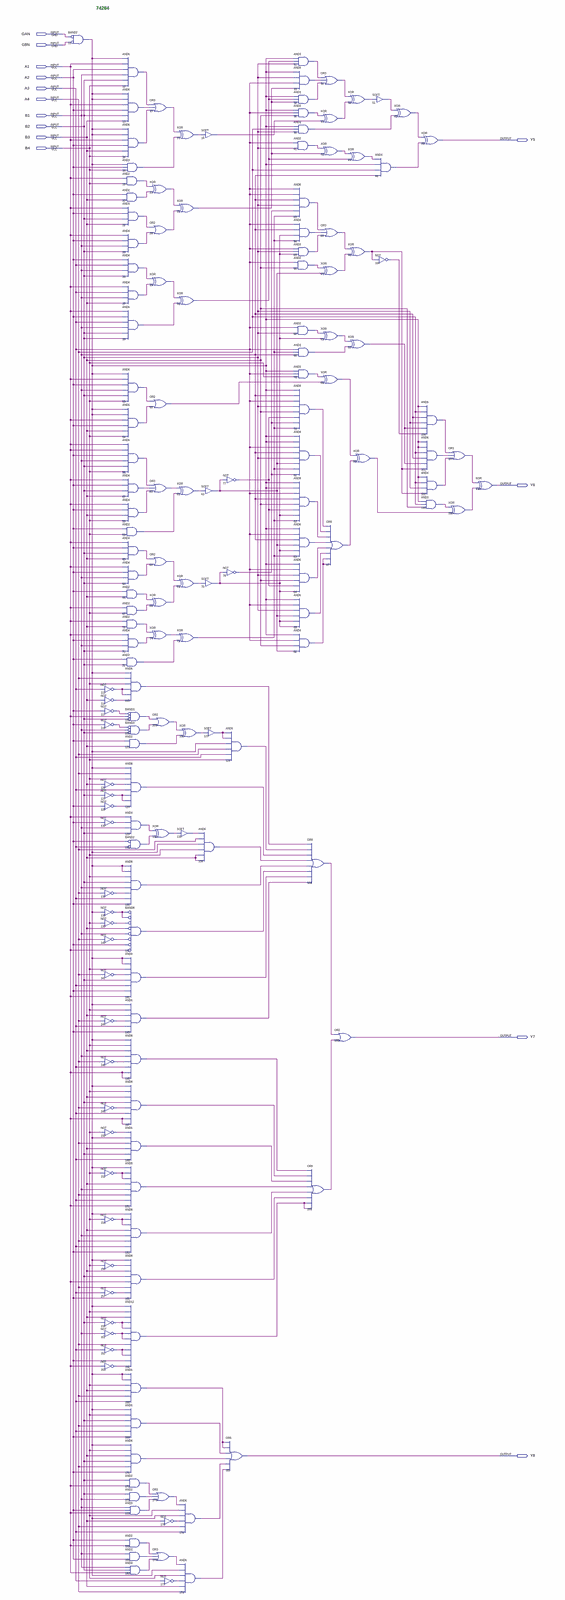
[diagram p0: schematic sheet, whole]
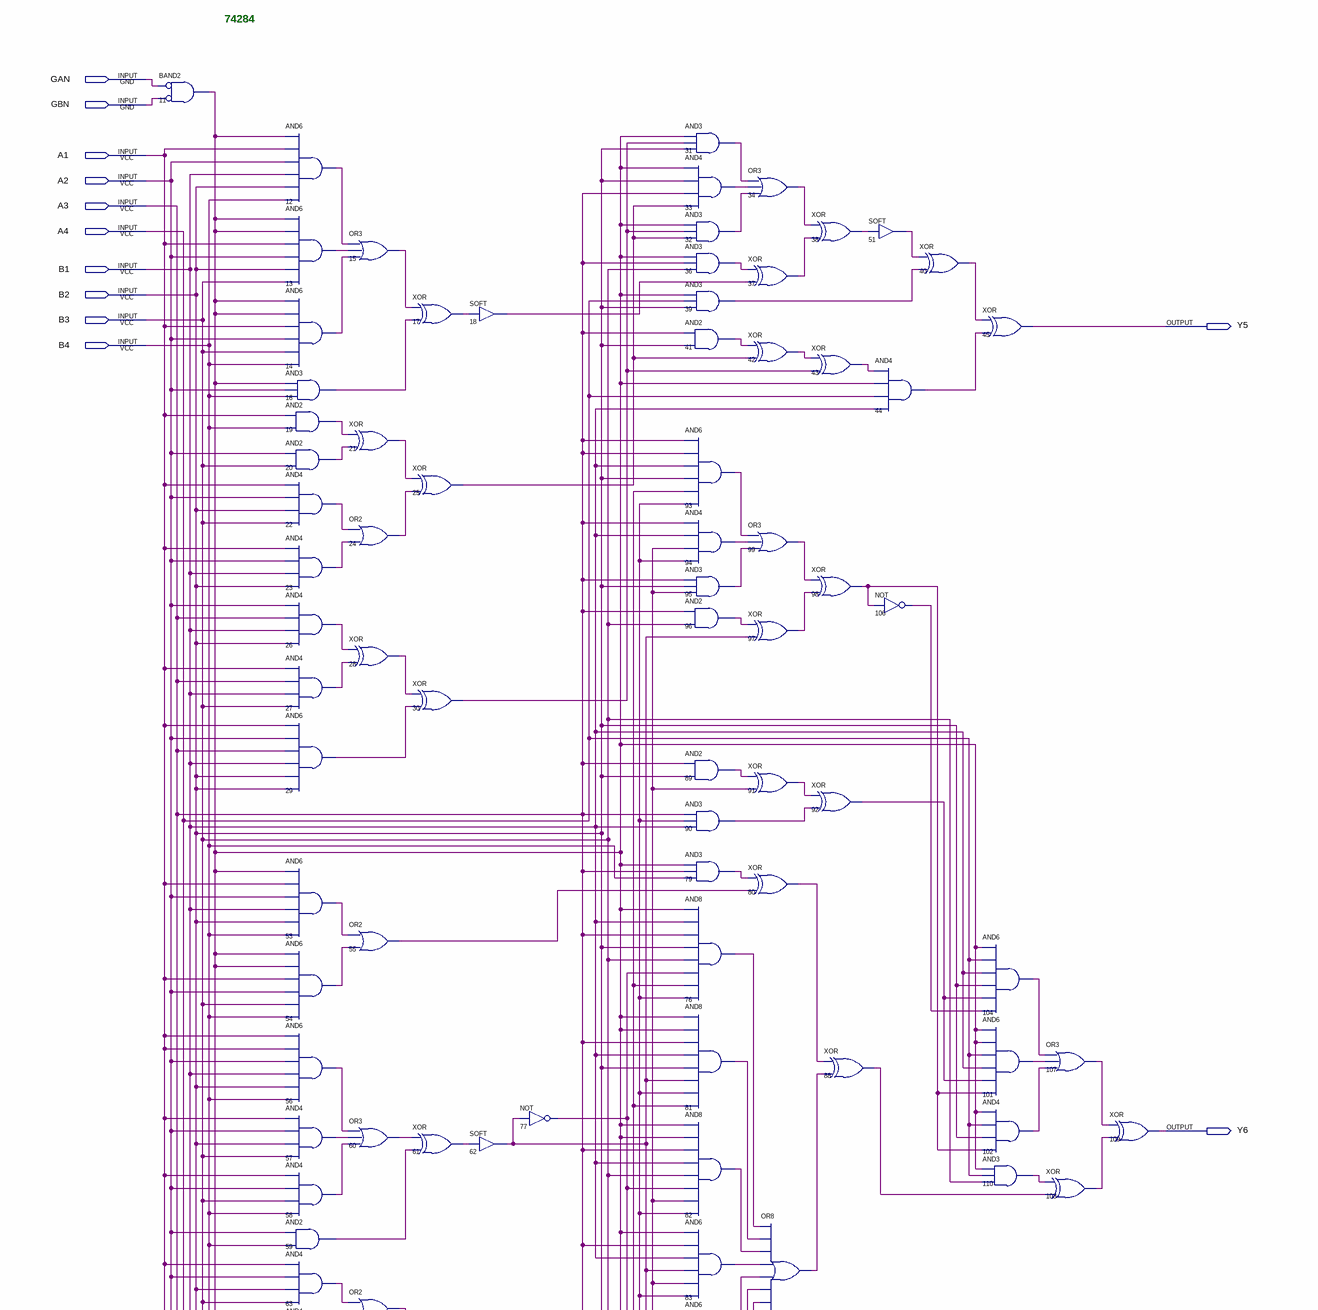
[diagram p1: schematic sheet, upper part]
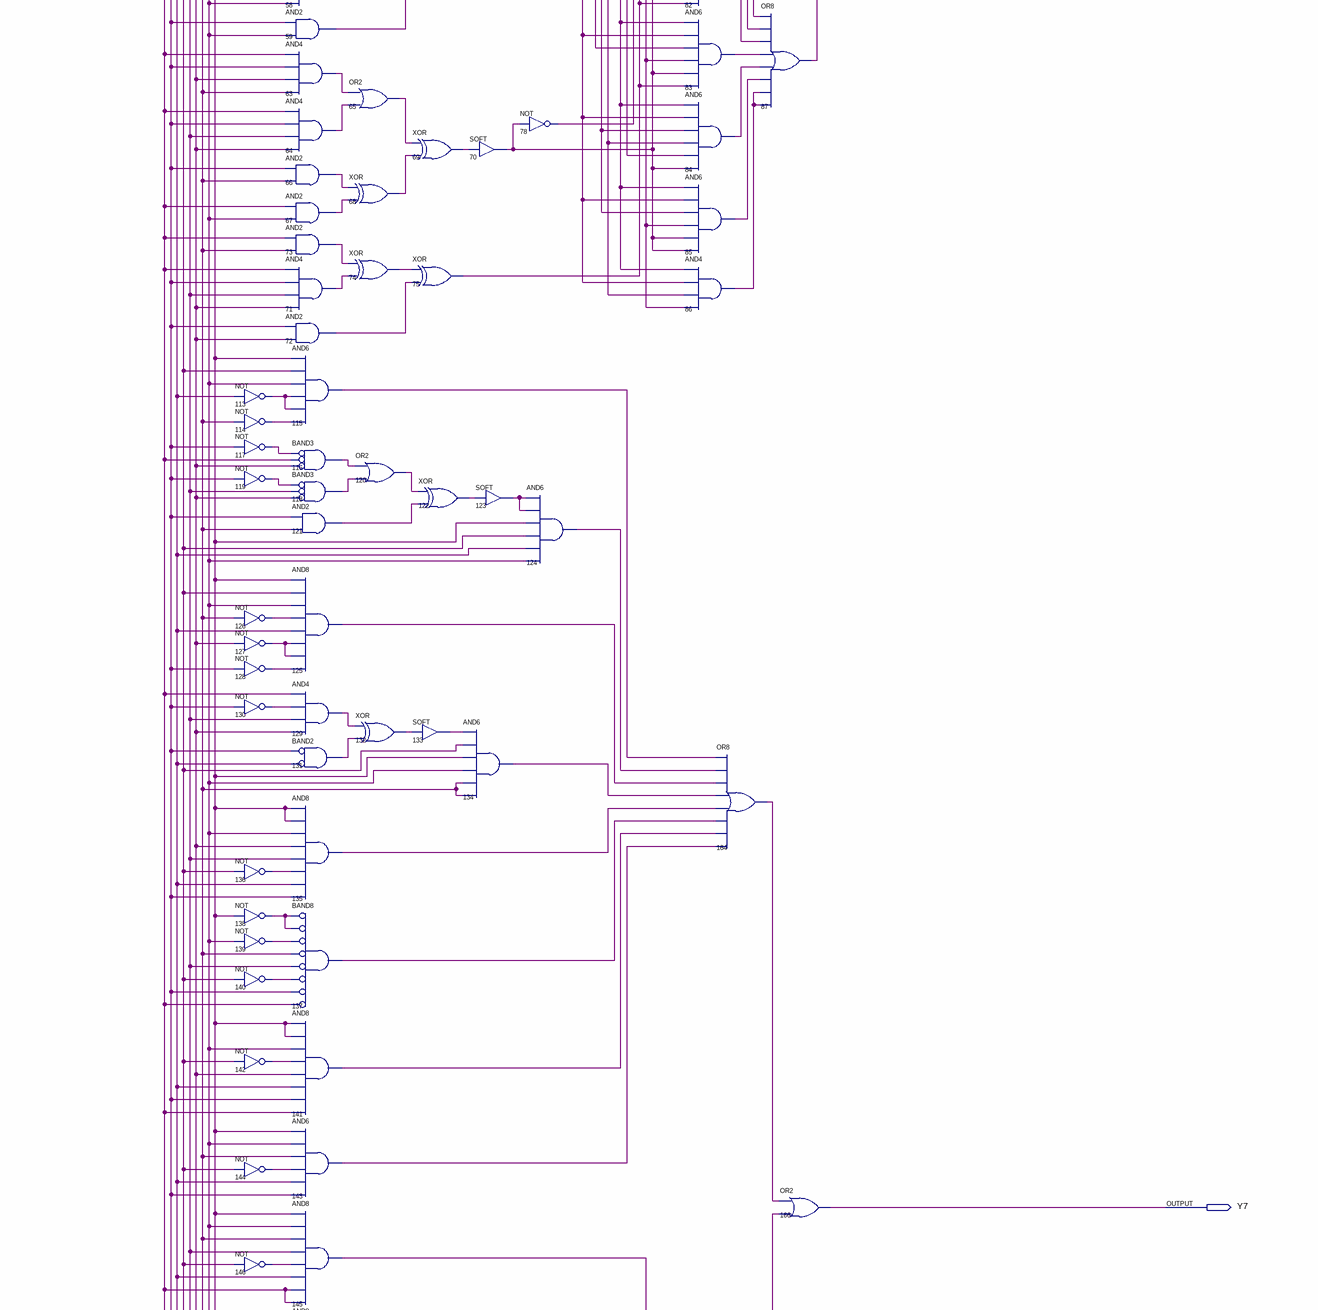
[diagram p2: schematic sheet, middle part]
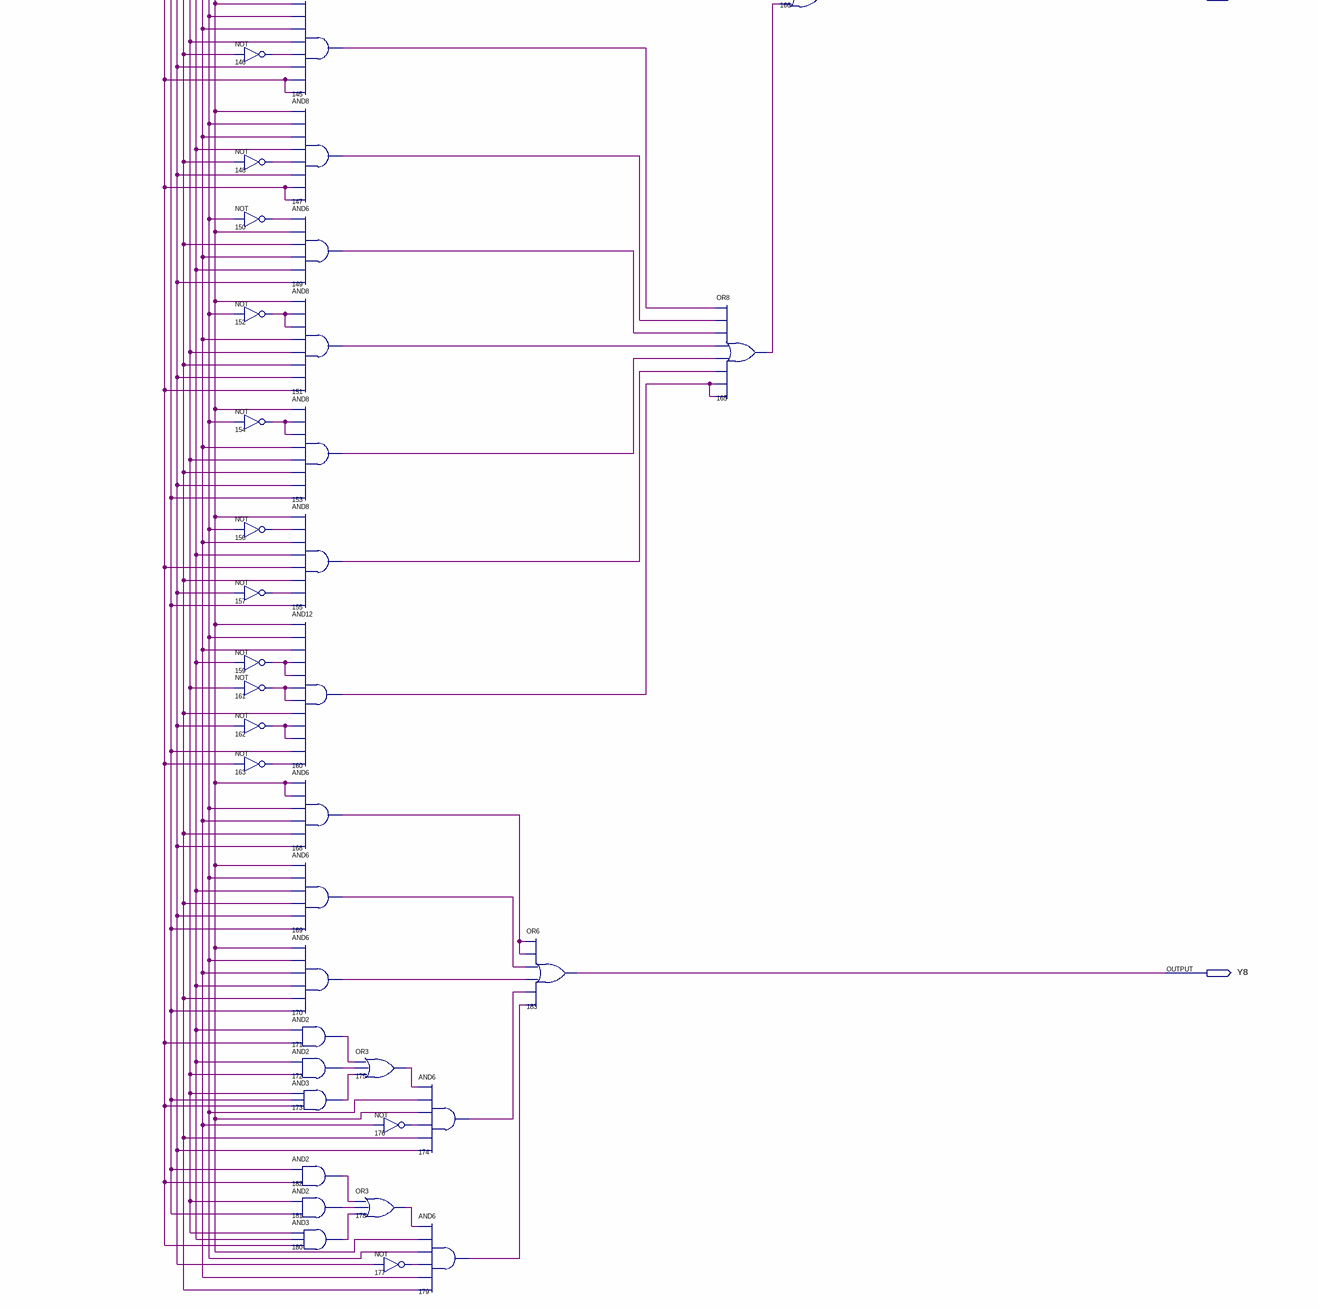
[diagram p3: schematic sheet, lower part]
// Quartus schematic 74284.bdf as structural Verilog: 159 symbols, 14 pins
module \74284  (
  input  GAN,
  input  GBN,
  input  A1,
  input  A2,
  input  A3,
  input  A4,
  input  B1,
  input  B2,
  input  B3,
  input  B4,
  output Y5,
  output Y6,
  output Y7,
  output Y8
);

  wire n11_out, n12_out, n13_out, n14_out, n15_out, n16_out, n17_out, n18_out, n19_out, n20_out, n21_out,
       n22_out, n23_out, n24_out, n25_out, n26_out, n27_out, n28_out, n29_out, n30_out, n31_out, n32_out,
       n33_out, n34_out, n36_out, n37_out, n38_out, n39_out, n40_out, n41_out, n42_out, n43_out, n44_out,
       n51_out, n53_out, n54_out, n55_out, n56_out, n57_out, n58_out, n59_out, n60_out, n61_out, n62_out,
       n63_out, n64_out, n65_out, n66_out, n67_out, n68_out, n69_out, n70_out, n71_out, n72_out, n73_out,
       n74_out, n75_out, n76_out, n77_out, n78_out, n79_out, n80_out, n81_out, n82_out, n83_out, n84_out,
       n85_out, n86_out, n87_out, n88_out, n89_out, n90_out, n91_out, n92_out, n93_out, n94_out, n95_out,
       n96_out, n97_out, n98_out, n99_out, n101_out, n102_out, n104_out, n106_out, n107_out, n108_out,
       n110_out, n113_out, n114_out, n115_out, n116_out, n117_out, n118_out, n119_out, n120_out, n121_out,
       n122_out, n123_out, n124_out, n125_out, n126_out, n127_out, n128_out, n129_out, n130_out, n131_out,
       n132_out, n133_out, n134_out, n135_out, n136_out, n137_out, n138_out, n139_out, n140_out, n141_out,
       n142_out, n143_out, n144_out, n145_out, n146_out, n147_out, n148_out, n149_out, n150_out, n151_out,
       n152_out, n153_out, n154_out, n155_out, n156_out, n157_out, n159_out, n160_out, n161_out, n162_out,
       n163_out, n164_out, n165_out, n168_out, n169_out, n170_out, n171_out, n172_out, n173_out, n174_out,
       n175_out, n176_out, n177_out, n178_out, n179_out, n180_out, n181_out, n182_out;

  and u_11 (n11_out, ~GAN, ~GBN);  // BAND2
  not u_113 (n113_out, A3);
  not u_114 (n114_out, B3);
  not u_117 (n117_out, A2);
  not u_119 (n119_out, A2);
  not u_126 (n126_out, B3);
  not u_127 (n127_out, B2);
  not u_128 (n128_out, A2);
  not u_130 (n130_out, A2);
  not u_136 (n136_out, A4);
  not u_138 (n138_out, n11_out);
  not u_139 (n139_out, B4);
  not u_140 (n140_out, A4);
  not u_142 (n142_out, A4);
  not u_144 (n144_out, A4);
  not u_146 (n146_out, A4);
  not u_148 (n148_out, A4);
  not u_150 (n150_out, B4);
  not u_152 (n152_out, B4);
  not u_154 (n154_out, B4);
  not u_156 (n156_out, B4);
  not u_157 (n157_out, A3);
  not u_159 (n159_out, B2);
  not u_161 (n161_out, B1);
  not u_162 (n162_out, A3);
  not u_163 (n163_out, A1);
  and u_12 (n12_out, n11_out, A1, A2, B1, B2, B4);
  and u_13 (n13_out, n11_out, n11_out, A1, A2, B2, B3);
  and u_14 (n14_out, n11_out, n11_out, A1, A2, B3, B4);
  and u_16 (n16_out, n11_out, A2, B4);
  and u_19 (n19_out, A1, B4);
  and u_20 (n20_out, A2, B3);
  and u_22 (n22_out, A1, A2, B2, B3);
  and u_23 (n23_out, A1, A2, B1, B2);
  and u_26 (n26_out, A2, A3, B1, B2);
  and u_27 (n27_out, A1, A3, B1, B3);
  and u_29 (n29_out, A1, A2, A3, B1, B2, B2);
  and u_53 (n53_out, n11_out, A1, A2, B1, B2, B4);
  and u_54 (n54_out, n11_out, n11_out, A1, A2, B3, B4);
  and u_56 (n56_out, A1, A1, A2, B1, B2, B4);
  and u_57 (n57_out, A1, A2, B2, B3);
  and u_58 (n58_out, A1, A2, B3, B4);
  and u_59 (n59_out, A2, B4);
  and u_63 (n63_out, A1, A2, B2, B3);
  and u_64 (n64_out, A1, A2, B1, B2);
  and u_66 (n66_out, A2, B3);
  and u_67 (n67_out, A1, B4);
  and u_73 (n73_out, A1, B3);
  and u_71 (n71_out, A1, A2, B1, B2);
  and u_72 (n72_out, A2, B2);
  and u_115 (n115_out, n11_out, A4, B4, n113_out, n113_out, n114_out);
  and u_116 (n116_out, ~n117_out, ~A1, ~B2);  // BAND3
  and u_118 (n118_out, ~n119_out, ~B1, ~B2);  // BAND3
  and u_121 (n121_out, A2, B3);
  and u_125 (n125_out, n11_out, A4, B4, n126_out, A3, n127_out, n127_out, n128_out);
  and u_129 (n129_out, A1, n130_out, B1, B2);
  and u_131 (n131_out, ~A2, ~A3);  // BAND2
  and u_135 (n135_out, n11_out, n11_out, B4, B2, B1, n136_out, A3, A2);
  and u_137 (n137_out, ~n138_out, ~n138_out, ~n139_out, ~B3, ~B1, ~n140_out, ~A2, ~A1);  // BAND8
  and u_141 (n141_out, n11_out, n11_out, B4, n142_out, B2, A3, A2, A1);
  and u_143 (n143_out, n11_out, B4, B3, n144_out, A3, A2);
  and u_145 (n145_out, n11_out, B4, B3, B1, n146_out, A3, A1, A1);
  and u_147 (n147_out, n11_out, B4, B3, B2, n148_out, A3, A1, A1);
  and u_149 (n149_out, n150_out, n11_out, A4, B3, B2, A3);
  and u_151 (n151_out, n11_out, n152_out, n152_out, B3, B1, A4, A3, A1);
  and u_153 (n153_out, n11_out, n154_out, n154_out, B3, B1, A4, A3, A2);
  and u_155 (n155_out, n11_out, n156_out, B3, B2, A1, A4, n157_out, A2);
  and u_160 (n160_out, n11_out, B4, B3, n159_out, n159_out, n161_out, n161_out, A4, n162_out, n162_out, A2, n163_out);
  and u_168 (n168_out, n11_out, n11_out, B4, B3, A4, A3);
  and u_169 (n169_out, n11_out, B4, B2, A4, A3, A2);
  and u_170 (n170_out, n11_out, B4, B3, B2, A4, A2);
  and u_171 (n171_out, B2, A1);
  and u_172 (n172_out, B2, B1);
  and u_173 (n173_out, B1, A2, A1);
  and u_182 (n182_out, A2, A1);
  and u_181 (n181_out, B1, A2);
  and u_180 (n180_out, B1, B2, A1);
  or u_15 (n15_out, n12_out, n13_out, n14_out);
  xor u_21 (n21_out, n19_out, n20_out);
  or u_24 (n24_out, n22_out, n23_out);
  xor u_28 (n28_out, n26_out, n27_out);
  or u_55 (n55_out, n53_out, n54_out);
  or u_60 (n60_out, n56_out, n57_out, n58_out);
  or u_65 (n65_out, n63_out, n64_out);
  xor u_68 (n68_out, n66_out, n67_out);
  xor u_74 (n74_out, n73_out, n71_out);
  or u_120 (n120_out, n116_out, n118_out);
  xor u_132 (n132_out, n129_out, n131_out);
  or u_175 (n175_out, n171_out, n172_out, n173_out);
  not u_176 (n176_out, B3);
  or u_178 (n178_out, n182_out, n181_out, n180_out);
  not u_177 (n177_out, A3);
  xor u_17 (n17_out, n15_out, n16_out);
  xor u_25 (n25_out, n21_out, n24_out);
  xor u_30 (n30_out, n28_out, n29_out);
  xor u_61 (n61_out, n60_out, n59_out);
  xor u_69 (n69_out, n65_out, n68_out);
  xor u_75 (n75_out, n74_out, n72_out);
  xor u_122 (n122_out, n120_out, n121_out);
  SOFT u_133 (.IN(n132_out), .OUT(n133_out));
  and u_174 (n174_out, n175_out, B4, n11_out, n176_out, A4, A3);
  and u_179 (n179_out, n178_out, n11_out, B4, n177_out, B3, A4);
  SOFT u_18 (.IN(n17_out), .OUT(n18_out));
  SOFT u_62 (.IN(n61_out), .OUT(n62_out));
  SOFT u_70 (.IN(n69_out), .OUT(n70_out));
  SOFT u_123 (.IN(n122_out), .OUT(n123_out));
  and u_134 (n134_out, n133_out, A4, n11_out, B4, B3, B3);
  not u_77 (n77_out, n62_out);
  not u_78 (n78_out, n70_out);
  and u_124 (n124_out, n123_out, n123_out, n11_out, A4, A3, B4);
  or u_183 (Y8, n168_out, n168_out, n169_out, n170_out, n174_out, n179_out);
  and u_31 (n31_out, n11_out, n30_out, B2);
  and u_33 (n33_out, n11_out, B2, A3, n25_out);
  and u_32 (n32_out, n11_out, n30_out, n25_out);
  and u_36 (n36_out, n11_out, A3, B3);
  and u_39 (n39_out, n11_out, A4, B2);
  and u_41 (n41_out, A3, B2);
  and u_93 (n93_out, A3, A3, B1, B2, n78_out, n75_out);
  and u_94 (n94_out, A3, B1, n70_out, n75_out);
  and u_95 (n95_out, A3, B2, n70_out);
  and u_96 (n96_out, A3, B3);
  and u_89 (n89_out, A3, B2);
  and u_90 (n90_out, A3, n75_out, B1);
  and u_79 (n79_out, n11_out, A3, B4);
  and u_76 (n76_out, n11_out, B1, A3, B2, B3, n77_out, n78_out, n75_out);
  and u_81 (n81_out, n11_out, n11_out, A3, B1, B2, n62_out, n75_out, n78_out);
  and u_82 (n82_out, n11_out, n11_out, A3, B1, B3, n77_out, n70_out, n75_out);
  and u_83 (n83_out, n11_out, A3, B1, n62_out, n70_out, n75_out);
  and u_84 (n84_out, n11_out, A3, B2, B3, n77_out, n70_out);
  and u_85 (n85_out, n11_out, A3, B2, n62_out, n70_out, n70_out);
  and u_86 (n86_out, n11_out, A3, B3, n62_out);
  or u_34 (n34_out, n31_out, n33_out, n32_out);
  xor u_37 (n37_out, n36_out, n18_out);
  xor u_42 (n42_out, n41_out, n25_out);
  or u_99 (n99_out, n93_out, n94_out, n95_out);
  xor u_97 (n97_out, n96_out, n62_out);
  xor u_91 (n91_out, n89_out, n70_out);
  xor u_80 (n80_out, n79_out, n55_out);
  or u_164 (n164_out, n115_out, n124_out, n125_out, n134_out, n135_out, n137_out, n141_out, n143_out);
  or u_165 (n165_out, n145_out, n147_out, n149_out, n151_out, n153_out, n155_out, n160_out, n160_out);
  or u_87 (n87_out, n76_out, n81_out, n82_out, n83_out, n84_out, n85_out, n86_out, n86_out);
  or u_166 (Y7, n164_out, n165_out);
  xor u_38 (n38_out, n34_out, n37_out);
  xor u_43 (n43_out, n42_out, n30_out);
  xor u_98 (n98_out, n99_out, n97_out);
  xor u_92 (n92_out, n91_out, n90_out);
  xor u_88 (n88_out, n80_out, n87_out);
  SOFT u_51 (.IN(n38_out), .OUT(n51_out));
  and u_44 (n44_out, n43_out, n11_out, A4, B1);
  not u_106 (n106_out, n98_out);
  xor u_40 (n40_out, n51_out, n39_out);
  xor u_45 (Y5, n40_out, n44_out);
  and u_104 (n104_out, n11_out, A4, B1, B2, n92_out, n106_out);
  and u_101 (n101_out, n11_out, n11_out, A4, B1, n92_out, n98_out);
  and u_102 (n102_out, n11_out, A4, B2, n98_out);
  and u_110 (n110_out, n11_out, A4, B3);
  or u_107 (n107_out, n104_out, n101_out, n102_out);
  xor u_108 (n108_out, n110_out, n88_out);
  xor u_109 (Y6, n107_out, n108_out);

  // Notes on the sheet:
  //   74284
endmodule
